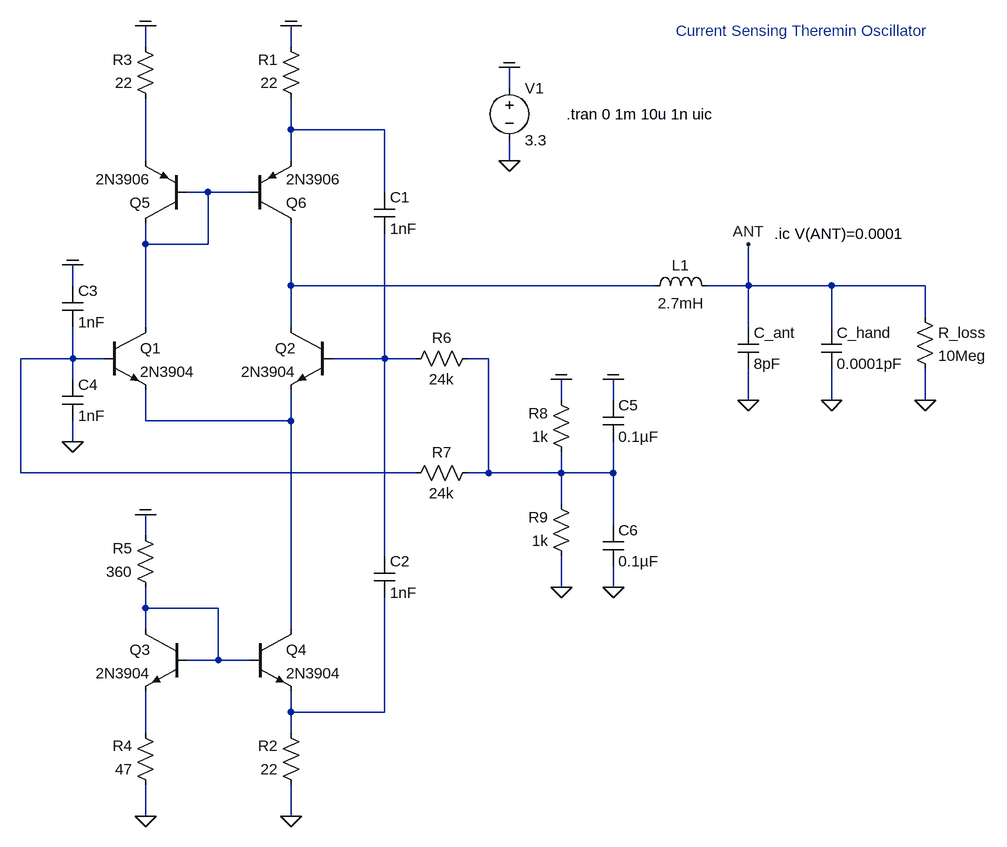
[diagram p0: schematic 2023_03_wallin_oscillator_bjt_power_rails_diff_amp_with_current_mirror_v01.asc]
2023_03_wallin_oscillator_bjt_power_rails_diff_amp_with_current_mirror_v01.asc, the LTspice schematic file:
Version 4
SHEET 1 16292 14340
WIRE 6992 7952 6992 7920
WIRE 7216 7952 7216 7920
WIRE 7552 8016 7552 7984
WIRE 7216 8080 7216 8032
WIRE 7360 8080 7216 8080
WIRE 6992 8128 6992 8032
WIRE 7216 8128 7216 8080
WIRE 7552 8128 7552 8096
WIRE 7088 8176 7056 8176
WIRE 7152 8176 7088 8176
WIRE 7360 8176 7360 8080
WIRE 6992 8256 6992 8224
WIRE 7088 8256 7088 8176
WIRE 7088 8256 6992 8256
WIRE 6880 8320 6880 8288
WIRE 7216 8320 7216 8224
WIRE 7776 8320 7216 8320
WIRE 7920 8320 7920 8256
WIRE 7920 8320 7856 8320
WIRE 8048 8320 7920 8320
WIRE 8192 8320 8048 8320
WIRE 8192 8368 8192 8320
WIRE 6992 8384 6992 8256
WIRE 7216 8384 7216 8320
WIRE 7920 8384 7920 8320
WIRE 8048 8384 8048 8320
WIRE 6880 8432 6880 8384
WIRE 6880 8432 6800 8432
WIRE 6928 8432 6880 8432
WIRE 7360 8432 7360 8240
WIRE 7360 8432 7280 8432
WIRE 7408 8432 7360 8432
WIRE 7520 8432 7488 8432
WIRE 6880 8464 6880 8432
WIRE 7632 8496 7632 8464
WIRE 7712 8496 7712 8464
WIRE 7920 8496 7920 8448
WIRE 8048 8496 8048 8448
WIRE 8192 8496 8192 8448
WIRE 6992 8528 6992 8480
WIRE 7216 8528 7216 8480
WIRE 7216 8528 6992 8528
WIRE 6880 8560 6880 8528
WIRE 6800 8608 6800 8432
WIRE 7408 8608 6800 8608
WIRE 7520 8608 7520 8432
WIRE 7520 8608 7488 8608
WIRE 7632 8608 7632 8576
WIRE 7632 8608 7520 8608
WIRE 7712 8608 7712 8560
WIRE 7712 8608 7632 8608
WIRE 7632 8656 7632 8608
WIRE 7712 8688 7712 8608
WIRE 6992 8704 6992 8672
WIRE 7360 8736 7360 8432
WIRE 7632 8784 7632 8736
WIRE 7712 8784 7712 8752
WIRE 6992 8816 6992 8784
WIRE 7104 8816 6992 8816
WIRE 6992 8848 6992 8816
WIRE 7216 8848 7216 8528
WIRE 7104 8896 7104 8816
WIRE 7104 8896 7056 8896
WIRE 7152 8896 7104 8896
WIRE 7216 8976 7216 8944
WIRE 7360 8976 7360 8800
WIRE 7360 8976 7216 8976
WIRE 6992 9008 6992 8944
WIRE 7216 9008 7216 8976
WIRE 6992 9136 6992 9088
WIRE 7216 9136 7216 9088
FLAG 7552 8128 0
FLAG 7552 7984 COM
FLAG 6992 8672 COM
FLAG 7920 8496 0
FLAG 7920 8256 ANT
FLAG 8048 8496 0
FLAG 8192 8496 0
FLAG 6992 7920 COM
FLAG 7216 7920 COM
FLAG 7216 9136 0
FLAG 6992 9136 0
FLAG 6880 8288 COM
FLAG 6880 8560 0
FLAG 7632 8464 COM
FLAG 7632 8784 0
FLAG 7712 8464 COM
FLAG 7712 8784 0
SYMBOL voltage 7552 8000 R0
WINDOW 123 0 0 Left 0
WINDOW 39 0 0 Left 0
SYMATTR InstName V1
SYMATTR Value 3.3
SYMBOL npn 6928 8384 R0
SYMATTR InstName Q1
SYMATTR Value 2N3904
SYMBOL npn 7280 8384 M0
SYMATTR InstName Q2
SYMATTR Value 2N3904
SYMBOL npn 7152 8848 R0
SYMATTR InstName Q4
SYMATTR Value 2N3904
SYMBOL npn 7056 8848 M0
SYMATTR InstName Q3
SYMATTR Value 2N3904
SYMBOL res 7008 8800 R180
WINDOW 0 36 76 Left 2
WINDOW 3 36 40 Left 2
SYMATTR InstName R5
SYMATTR Value 360
SYMBOL cap 7904 8384 R0
SYMATTR InstName C_ant
SYMATTR Value 8pF
SYMBOL cap 8032 8384 R0
SYMATTR InstName C_hand
SYMATTR Value 0.0001pF
SYMBOL res 8176 8352 R0
WINDOW 0 36 40 Left 2
WINDOW 3 36 76 Left 2
SYMATTR InstName R_loss
SYMATTR Value 10Meg
SYMBOL ind 7760 8336 R270
WINDOW 0 32 56 VTop 2
WINDOW 3 5 56 VBottom 2
SYMATTR InstName L1
SYMATTR Value 2.7mH
SYMATTR SpiceLine Ipk=0.5 Rser=120 Cpar=1.1pF
SYMBOL pnp 7152 8224 M180
SYMATTR InstName Q6
SYMATTR Value 2N3906
SYMBOL pnp 7056 8224 R180
SYMATTR InstName Q5
SYMATTR Value 2N3906
SYMBOL res 7008 8048 R180
WINDOW 0 36 76 Left 2
WINDOW 3 36 40 Left 2
SYMATTR InstName R3
SYMATTR Value 22
SYMBOL res 7232 8048 R180
WINDOW 0 36 76 Left 2
WINDOW 3 36 40 Left 2
SYMATTR InstName R1
SYMATTR Value 22
SYMBOL res 7232 9104 R180
WINDOW 0 36 76 Left 2
WINDOW 3 36 40 Left 2
SYMATTR InstName R2
SYMATTR Value 22
SYMBOL res 7008 9104 R180
WINDOW 0 36 76 Left 2
WINDOW 3 36 40 Left 2
SYMATTR InstName R4
SYMATTR Value 47
SYMBOL cap 7344 8736 R0
SYMATTR InstName C2
SYMATTR Value 1nF
SYMBOL cap 7344 8176 R0
SYMATTR InstName C1
SYMATTR Value 1nF
SYMBOL res 7392 8448 R270
WINDOW 0 32 56 VTop 2
WINDOW 3 0 56 VBottom 2
SYMATTR InstName R6
SYMATTR Value 24k
SYMBOL cap 6864 8320 R0
SYMATTR InstName C3
SYMATTR Value 1nF
SYMBOL cap 6864 8464 R0
SYMATTR InstName C4
SYMATTR Value 1nF
SYMBOL res 7648 8592 R180
WINDOW 0 36 76 Left 2
WINDOW 3 36 40 Left 2
SYMATTR InstName R8
SYMATTR Value 1k
SYMBOL res 7648 8752 R180
WINDOW 0 36 76 Left 2
WINDOW 3 36 40 Left 2
SYMATTR InstName R9
SYMATTR Value 1k
SYMBOL cap 7696 8496 R0
SYMATTR InstName C5
SYMATTR Value 0.1µF
SYMBOL cap 7696 8688 R0
SYMATTR InstName C6
SYMATTR Value 0.1µF
SYMBOL res 7392 8624 R270
WINDOW 0 32 56 VTop 2
WINDOW 3 0 56 VBottom 2
SYMATTR InstName R7
SYMATTR Value 24k
TEXT 7640 8056 Left 2 !.tran 0 1m 10u 1n uic
TEXT 7808 7928 Left 2 ;Current Sensing Theremin Oscillator
TEXT 7960 8240 Left 2 !.ic V(ANT)=0.0001

The netlist it stands for:
* 2023_03_wallin_oscillator_bjt_power_rails_diff_amp_with_current_mirror_v01.asc
V1 COM 0 3.3
Q1 N003 N005 N008 0 2N3904
Q2 N004 N006 N008 0 2N3904
Q4 N008 N009 N010 0 2N3904
Q3 N009 N009 N011 0 2N3904
R5 N009 COM 360
C_ant ANT 0 8pF
C_hand ANT 0 0.0001pF
R_loss ANT 0 10Meg
L1 N004 ANT 2.7mH Ipk=0.5 Rser=120 Cpar=1.1pF
Q6 N004 N003 N001 0 2N3906
Q5 N003 N003 N002 0 2N3906
R3 N002 COM 22
R1 N001 COM 22
R2 0 N010 22
R4 0 N011 47
C2 N006 N010 1nF
C1 N001 N006 1nF
R6 N006 N007 24k
C3 COM N005 1nF
C4 N005 0 1nF
R8 N007 COM 1k
R9 0 N007 1k
C5 COM N007 0.1µF
C6 N007 0 0.1µF
R7 N005 N007 24k
.model NPN NPN
.model PNP PNP
.lib standard.bjt
.tran 0 1m 10u 1n uic
* Current Sensing Theremin Oscillator
.ic V(ANT)=0.0001
.backanno
.end